# EAGLE design rev_B (EAGLE 8.6.3)
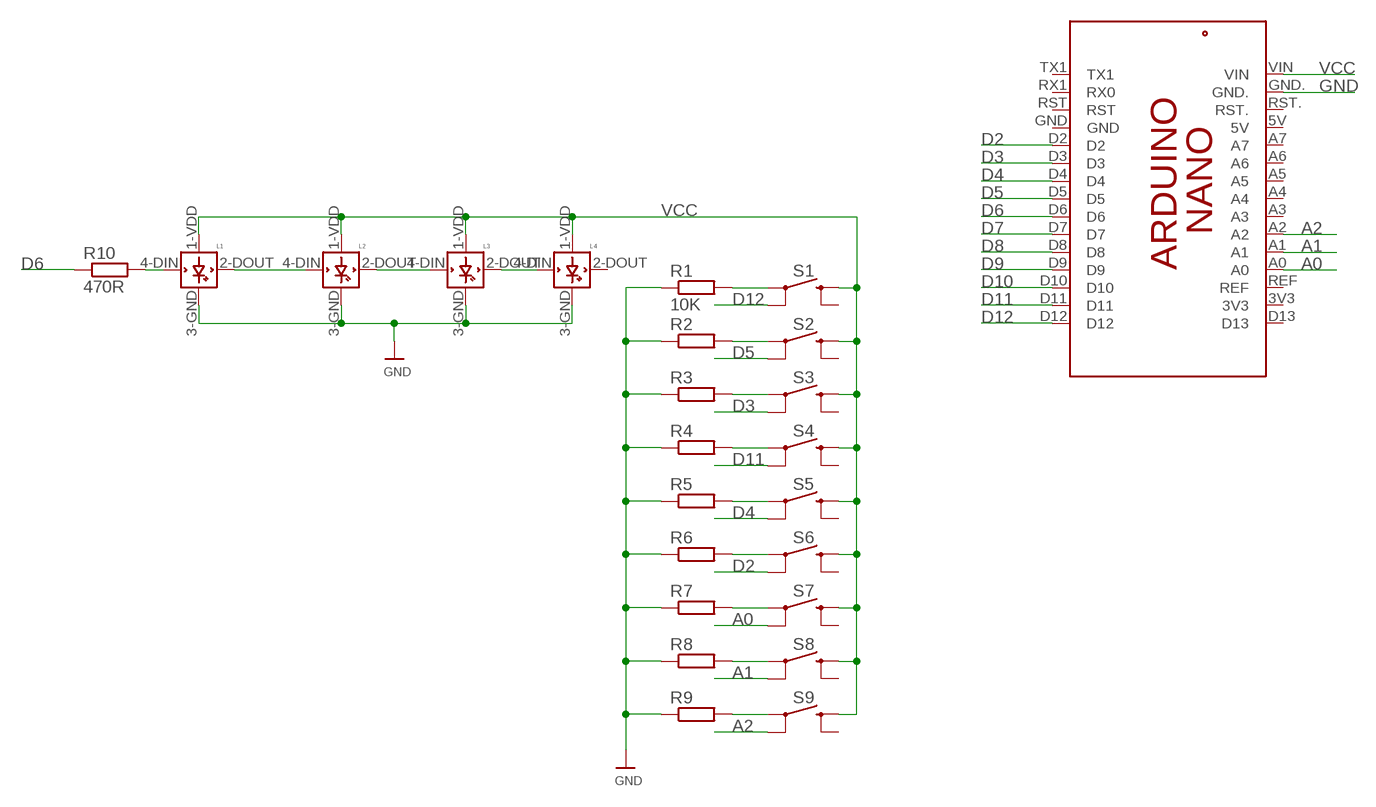
[diagram p0: schematic, sheet 1]

## Parts
L1  WS2812B  [WS2812B]
L2  WS2812B  [WS2812B]
L3  WS2812B  [WS2812B]
L4  WS2812B  [WS2812B]
PCB1  ARDUINO_NANO  [ARDUINO_NANO]
R1  10K  R-EU_R0805  [R0805]
R2  R-EU_R0805  [R0805]
R3  R-EU_R0805  [R0805]
R4  R-EU_R0805  [R0805]
R5  R-EU_R0805  [R0805]
R6  R-EU_R0805  [R0805]
R7  R-EU_R0805  [R0805]
R8  R-EU_R0805  [R0805]
R9  R-EU_R0805  [R0805]
R10  470R  R-EU_R0805  [R0805]
S1  TACT_SWITCH_12MM  [TACT_SWITCH_12MM]
S2  TACT_SWITCH_12MM  [TACT_SWITCH_12MM]
S3  TACT_SWITCH_12MM  [TACT_SWITCH_12MM]
S4  TACT_SWITCH_12MM  [TACT_SWITCH_12MM]
S5  TACT_SWITCH_12MM  [TACT_SWITCH_12MM]
S6  TACT_SWITCH_12MM  [TACT_SWITCH_12MM]
S7  TACT_SWITCH_12MM  [TACT_SWITCH_12MM]
S8  TACT_SWITCH_12MM  [TACT_SWITCH_12MM]
S9  TACT_SWITCH_12MM  [TACT_SWITCH_12MM]

## Nets
A0: PCB1.A0 S7.2
A1: PCB1.A1 S8.2
A2: PCB1.A2 S9.2
D2: PCB1.D2 S6.2
D3: PCB1.D3 S3.2
D4: PCB1.D4 S5.2
D5: PCB1.D5 S2.2
D6: PCB1.D6 R10.1
D7: PCB1.D7
D8: PCB1.D8
D9: PCB1.D9
D10: PCB1.D10
D11: PCB1.D11 S4.2
D12: PCB1.D12 S1.2
GND: L1.3-GND(GND) L2.3-GND(GND) L3.3-GND(GND) L4.3-GND(GND) PCB1.GND. R1.1 R2.1 R3.1 R4.1 R5.1 R6.1 R7.1 R8.1 R9.1
N$1: R1.2 S1.1
N$2: L1.4-DIN(DIN) R10.2
N$3: R9.2 S9.1
N$4: R8.2 S8.1
N$5: R7.2 S7.1
N$6: R6.2 S6.1
N$7: R5.2 S5.1
N$8: R4.2 S4.1
N$9: R3.2 S3.1
N$10: R2.2 S2.1
N$21: L1.2-DOUT(DOUT) L2.4-DIN(DIN)
N$22: L2.2-DOUT(DOUT) L3.4-DIN(DIN)
N$23: L3.2-DOUT(DOUT) L4.4-DIN(DIN)
VCC: L1.1-VDD(VDD) L2.1-VDD(VDD) L3.1-VDD(VDD) L4.1-VDD(VDD) PCB1.VIN S1.3 S2.3 S3.3 S4.3 S5.3 S6.3 S7.3 S8.3 S9.3
Unconnected: L4.2-DOUT(DOUT) PCB1.3V3 PCB1.5V PCB1.A3 PCB1.A4 PCB1.A5 PCB1.A6 PCB1.A7 PCB1.D13 PCB1.GND PCB1.REF PCB1.RST PCB1.RST. PCB1.RX1(RX0) PCB1.TX1 S1.4 S2.4 S3.4 S4.4 S5.4 S6.4 S7.4 S8.4 S9.4

## Library data of the parts
L1-L4 = dronecz:WS2812B
PCB1 = E14_Arduino_published:ARDUINO_NANO: Device for representing an Arduino Nano board with a footprint in an EAGLE design. Created by Dave Young for Element14. More EAGLE documentation at: http://www.element14.com/community/community/knode/cadsoft_eagle
R1-R10 = rcl:R-EU_: RESISTOR, European symbol; SPICEPREFIX: R
S1-S9 = dronecz:TACT_SWITCH_12MM

## Board
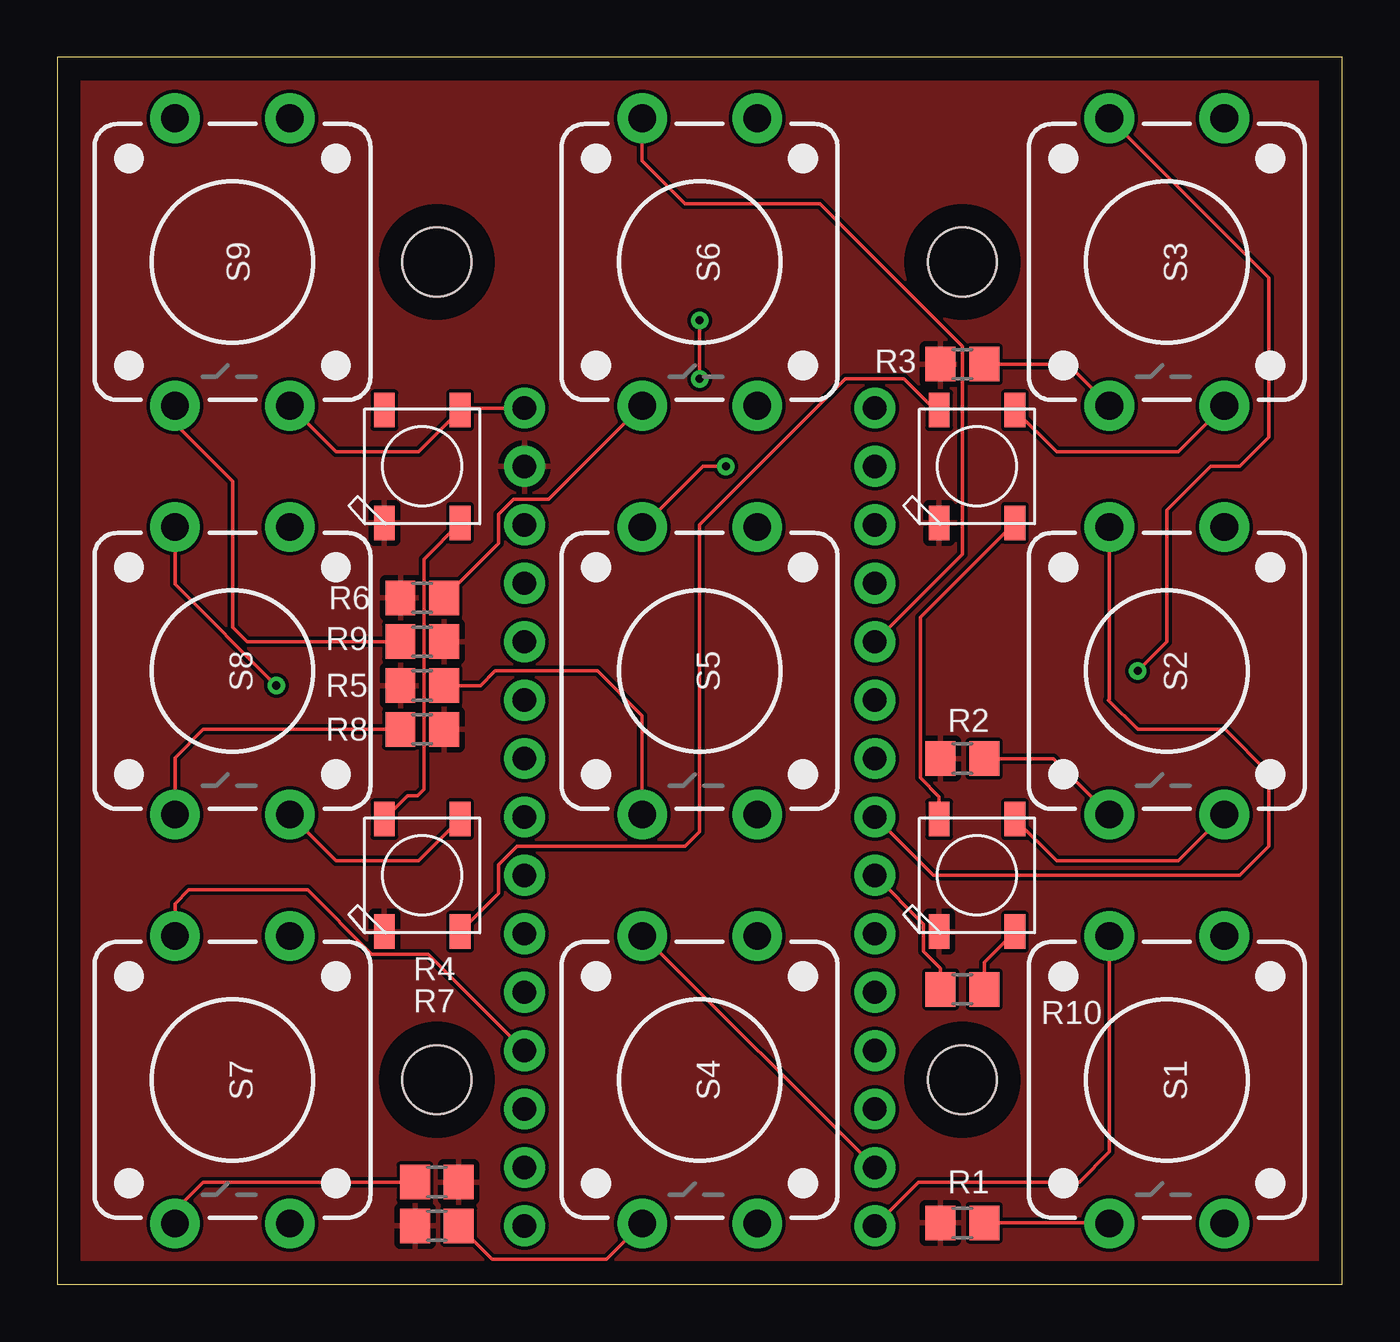
[diagram p1: board, top side]
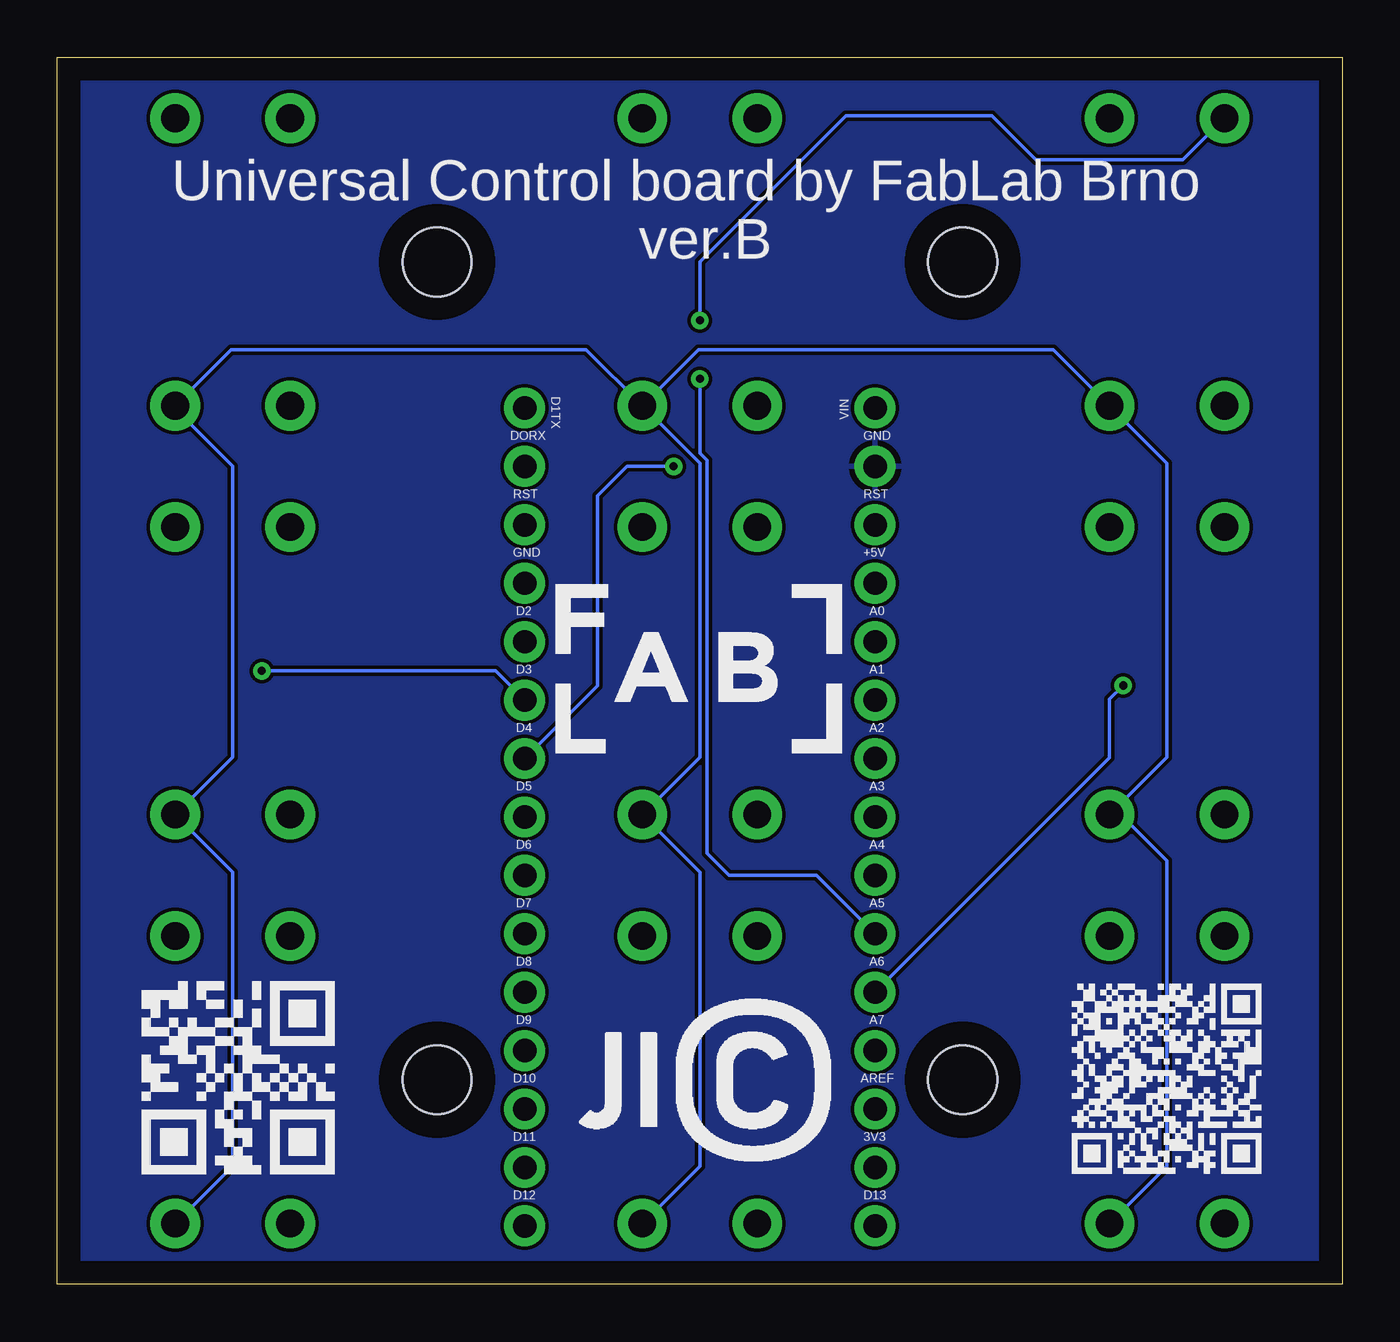
[diagram p2: board, bottom side, seen from below]

Size 55.87 x 53.34 mm. Coordinates in mm from the lower left corner, seen from the top.
Outline: 55.87,0 55.87,53.34 0,53.34 0,0 55.87,0
Copper layers (1*16): Top 0.035mm / dielectric 1.5mm / Bottom 0.035mm
Design rules "default": minimum track width 6mil, minimum drill 0.35mm, track to track 6mil, track to pad 6mil, pad to pad 6mil, via to via 6mil, smd to smd 6mil, copper to edge 40mil, drill to drill 6mil, minimum pad ring 10mil, minimum via ring 8mil, stop-mask expansion 4mil, vias tented up to drill 0mil, thermal gap 10mil
Holes 3 mm at 39.36,8.89 39.36,44.45 16.5,44.45 16.5,8.89

### Footprints (pad centres in the part's own frame; a part is rotated, then mirrored left to right if it is on the bottom)
WS2812B = smd 1.5 x 0.9: 1-VDD 2.45,-1.65; 2-DOUT 2.45,1.65; 3-GND -2.45,1.65; 4-DIN -2.45,-1.65
ARDUINO_NANO = drill 1.016 pad 1.778: 3V3 6.35,1.27; 5V 31.75,1.27; A0 11.43,1.27; A1 13.97,1.27; A2 16.51,1.27; A3 19.05,1.27; A4 21.59,1.27; A5 24.13,1.27; A6 26.67,1.27; A7 29.21,1.27; D2 29.21,16.51; D3 26.67,16.51; D4 24.13,16.51; D5 21.59,16.51; D6 19.05,16.51; D7 16.51,16.51; D8 13.97,16.51; D9 11.43,16.51; D10 8.89,16.51; D11 6.35,16.51; D12 3.81,16.51; D13 3.81,1.27; GND 31.75,16.51; GND. 36.83,1.27; REF 8.89,1.27; RST 34.29,16.51; RST. 34.29,1.27; RX1 36.83,16.51; TX1 39.37,16.51; VIN 39.37,1.27
R0805 = smd 1.3 x 1.5: 1 -0.95,0; 2 0.95,0
TACT_SWITCH_12MM = drill 1.2 pad 2.159: 1 6.25,-2.5; 2 -6.25,-2.5; 3 6.25,2.5; 4 -6.25,2.5

### Placement (x,y rotation side)
L1  40,17.78 90 top
L2  40,35.56 90 top
L3  15.87,17.78 90 top
L4  15.87,35.56 90 top
PCB1  19.04,-1.27 90 bottom
R1  39.36,2.67 0 top
R2  39.36,22.86 0 top
R3  39.36,40.01 0 top
R4  16.5,2.54 0 top
R5  15.87,26.04 0 top
R6  15.87,29.84 0 top
R7  16.5,4.45 180 top
R8  15.87,24.13 180 top
R9  15.87,27.94 180 top
R10  39.36,12.83 0 top
S1  48.25,8.89 270 top
S2  48.25,26.67 270 top
S3  48.25,44.45 270 top
S4  27.93,8.89 270 top
S5  27.93,26.67 270 top
S6  27.93,44.45 270 top
S7  7.61,8.89 270 top
S8  7.61,26.67 270 top
S9  7.61,44.45 270 top

### Tracks (layer width: path | path; a pad name or v marks a point on that pad's centre or on a via)
A0
  Top 0.152: PCB1.A0 16.12,14.35 13.67,14.35 10.88,17.14 5.71,17.14 5.11,16.55 S7.2
A1  (via drill 0.35)
  Top 0.152: v9.52,26.04 5.11,30.44 S8.2
  Bottom 0.152: PCB1.A1 10.11,22.9 10.11,25.44 v9.52,26.04
A2  (via drill 0.35)
  Top 0.152: v27.93,41.91 v27.93,39.37
  Bottom 0.152: v27.93,41.91 27.93,44.45 21.58,50.8 15.23,50.8 13.33,48.9 6.92,48.9 S9.2 | v27.93,39.37 27.93,36.13 27.62,35.83 27.62,18.75 26.66,17.78 22.85,17.78 PCB1.A2
D2
  Top 0.152: PCB1.D2 39.36,31.75 39.36,40.78 36.89,43.25 36.77,43.38 33.15,46.99 27.29,46.99 25.43,48.85 S6.2
D3  (via drill 0.35)
  Top 0.152: v46.98,26.67 48.25,27.94 48.25,33.66 50.16,35.56 51.43,35.56 52.7,36.83 52.7,43.76 S3.2
  Bottom 0.152: PCB1.D3 36.82,26.67 v46.98,26.67
D4  (via drill 0.35)
  Top 0.152: S5.2 28.07,35.56 v29.07,35.56
  Bottom 0.152: PCB1.D4 32.38,26.04 32.38,34.29 31.1,35.56 v29.07,35.56
D5
  Top 0.152: PCB1.D5 38.09,17.78 51.43,17.78 52.7,19.05 52.7,22.23 50.79,24.13 46.98,24.13 45.71,25.4 45.75,25.44 S2.2
D6
  Top 0.152: PCB1.D6 37.67,15.66 37.67,14.48 38.41,13.74 R10.1
D11
  Top 0.152: S4.2 25.49,15.14 PCB1.D11
D12
  Top 0.152: PCB1.D12 37.46,4.45 44.44,4.45 45.75,5.75 S1.2
GND
  pour Top: -2.55,-2.54 58.41,-2.54 58.41,58.42 -2.55,58.42
  pour Bottom: -5.09,-5.08 60.95,-5.08 60.95,60.96 -5.09,60.96
N$1
  Top 0.152: R1.2 45.72,2.67 S1.1
N$2
  Top 0.152: R10.2 40.31,13.99 L1.4-DIN
N$3
  Top 0.152: S9.1 5.11,37.42 7.61,34.92 7.61,28.57 8.25,27.94 R9.2
N$4
  Top 0.152: S8.1 5.11,22.9 6.34,24.13 R8.2
N$5
  Top 0.152: S7.1 5.11,3.21 6.34,4.45 R7.2
N$6
  Top 0.152: S6.1 21.37,34.14 19.85,34.14 19.19,33.48 19.19,32.22 R6.2
N$7
  Top 0.152: S5.1 25.43,24.73 23.48,26.67 19.04,26.67 18.4,26.04 R5.2
N$8
  Top 0.152: R4.2 18.9,1.09 23.88,1.09 S4.1
N$9
  Top 0.152: R3.2 43.95,40.01 S3.1
N$10
  Top 0.152: R2.2 43.31,22.86 S2.1
N$21
  Top 0.152: L1.2-DOUT 38.34,21.2 37.53,22.02 37.53,29 L2.4-DIN
N$22
  Top 0.152: L3.4-DIN 19.19,17.01 19.19,18.24 20,19.05 27.29,19.05 27.93,19.68 27.93,33.02 34.28,39.37 36.82,39.37 38.18,38.01 L2.2-DOUT
N$23
  Top 0.152: L3.2-DOUT 15.23,21.25 15.66,21.25 15.94,21.52 15.94,31.53 L4.4-DIN
VCC
  Top 0.152: L1.1-VDD 43.46,18.41 48.75,18.41 S2.3 | L2.1-VDD 43.46,36.2 48.75,36.2 S3.3 | S9.3 12.12,36.2 15.7,36.2 L4.1-VDD 17.6,38.1 PCB1.VIN | S8.3 12.12,18.41 15.7,18.41 L3.1-VDD
  Bottom 0.152: S7.3 7.61,5.14 7.61,18.41 9.62,20.42 S8.3 7.61,22.92 7.61,35.7 S9.3 12.55,40.64 27.99,40.64 S6.3 | S4.3 27.93,5.14 27.93,17.92 S5.3 27.93,22.92 27.93,35.7 S6.3 | S1.3 48.25,5.14 48.25,17.92 S2.3 48.25,22.92 48.25,35.56 50.75,38.06 S3.3 48.31,40.64 32.87,40.64 S6.3

### Text on the board
bPlace: Universal Control board by FabLab Brno | ver.B